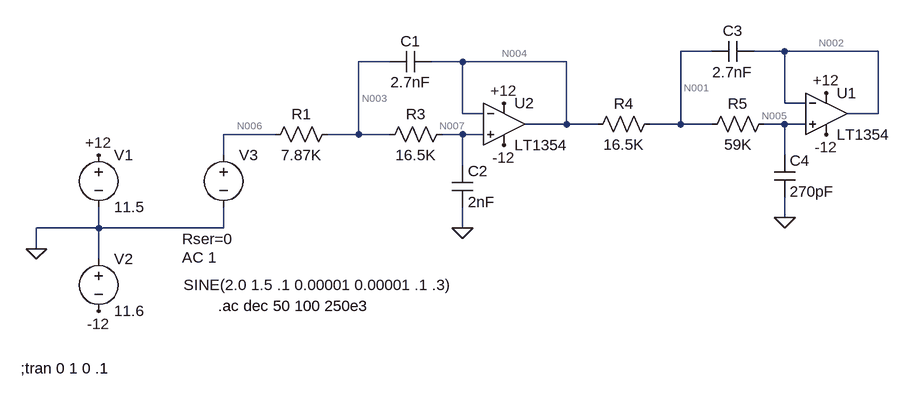
[diagram p0: schematic final_output.asc]
final_output.asc, the LTspice schematic file:
Version 4
SHEET 1 1348 680
WIRE 944 -128 896 -128
WIRE 1056 -128 1008 -128
WIRE 1200 -128 1056 -128
WIRE 448 -112 400 -112
WIRE 560 -112 512 -112
WIRE 720 -112 560 -112
WIRE 1056 -48 1056 -128
WIRE 1088 -48 1056 -48
WIRE 560 -32 560 -112
WIRE 592 -32 560 -32
WIRE 1200 -32 1200 -128
WIRE 1200 -32 1152 -32
WIRE 720 -16 720 -112
WIRE 720 -16 656 -16
WIRE 768 -16 720 -16
WIRE 896 -16 896 -128
WIRE 896 -16 848 -16
WIRE 944 -16 896 -16
WIRE 1056 -16 1024 -16
WIRE 1088 -16 1056 -16
WIRE 272 0 192 0
WIRE 400 0 400 -112
WIRE 400 0 352 0
WIRE 448 0 400 0
WIRE 560 0 528 0
WIRE 592 0 560 0
WIRE 192 32 192 0
WIRE 1056 32 1056 -16
WIRE 560 48 560 0
WIRE 1056 128 1056 96
WIRE 0 144 0 112
WIRE 0 144 -96 144
WIRE 192 144 192 112
WIRE 192 144 0 144
WIRE 560 144 560 112
WIRE -96 176 -96 144
WIRE 0 192 0 144
FLAG -96 176 0
FLAG 0 32 +12
FLAG 0 272 -12
FLAG 560 144 0
FLAG 624 -48 +12
FLAG 624 16 -12
FLAG 1056 128 0
FLAG 1120 -64 +12
FLAG 1120 0 -12
SYMBOL voltage 0 16 R0
WINDOW 123 0 0 Left 0
WINDOW 39 0 0 Left 0
SYMATTR InstName V1
SYMATTR Value 11.5
SYMBOL voltage 0 176 R0
WINDOW 123 0 0 Left 0
WINDOW 39 0 0 Left 0
SYMATTR InstName V2
SYMATTR Value 11.6
SYMBOL res 368 -16 R90
WINDOW 0 0 56 VBottom 2
WINDOW 3 32 56 VTop 2
SYMATTR InstName R1
SYMATTR Value 7.87K
SYMBOL voltage 192 16 R0
WINDOW 3 -61 216 Left 2
WINDOW 123 -64 173 Left 2
WINDOW 39 -64 145 Left 2
SYMATTR Value SINE(2.0 1.5 .1 0.00001 0.00001 .1 .3)
SYMATTR Value2 AC 1
SYMATTR SpiceLine Rser=0
SYMATTR InstName V3
SYMBOL cap 512 -128 R90
WINDOW 0 0 32 VBottom 2
WINDOW 3 32 32 VTop 2
SYMATTR InstName C1
SYMATTR Value 2.7nF
SYMBOL OpAmps\\LT1354 624 -80 R0
SYMATTR InstName U2
SYMBOL res 544 -16 R90
WINDOW 0 0 56 VBottom 2
WINDOW 3 32 56 VTop 2
SYMATTR InstName R3
SYMATTR Value 16.5K
SYMBOL cap 544 48 R0
SYMATTR InstName C2
SYMATTR Value 2nF
SYMBOL res 864 -32 R90
WINDOW 0 0 56 VBottom 2
WINDOW 3 32 56 VTop 2
SYMATTR InstName R4
SYMATTR Value 16.5K
SYMBOL cap 1008 -144 R90
WINDOW 0 0 32 VBottom 2
WINDOW 3 32 32 VTop 2
SYMATTR InstName C3
SYMATTR Value 2.7nF
SYMBOL OpAmps\\LT1354 1120 -96 R0
SYMATTR InstName U1
SYMBOL res 1040 -32 R90
WINDOW 0 0 56 VBottom 2
WINDOW 3 32 56 VTop 2
SYMATTR InstName R5
SYMATTR Value 59K
SYMBOL cap 1040 32 R0
SYMATTR InstName C4
SYMATTR Value 270pF
TEXT -120 360 Left 2 !;tran 0 1 0 .1
TEXT 184 264 Left 2 !.ac dec 50 100 250e3

The netlist it stands for:
* final_output.asc
V1 +12 0 11.5
V2 0 -12 11.6
R1 N003 N006 7.87K
V3 N006 0 SINE(2.0 1.5 .1 0.00001 0.00001 .1 .3) AC 1 Rser=0
C1 N004 N003 2.7nF
XU2 N007 N004 +12 -12 N004 LT1354  ; pins In+ In- V+ V- OUT
R3 N007 N003 16.5K
C2 N007 0 2nF
R4 N001 N004 16.5K
C3 N002 N001 2.7nF
XU1 N005 N002 +12 -12 N002 LT1354  ; pins In+ In- V+ V- OUT
R5 N005 N001 59K
C4 N005 0 270pF
;tran 0 1 0 .1
.ac dec 50 100 250e3
.backanno
.end

* Results of the author's LTspice run, read from the files saved beside the schematic
* Operating Point, zero values left out:
*   V(+12) = 11.5 V
*   V(-12) = -11.6 V
*   V(n003) = 2.002 V
*   V(n006) = 2.003 V
*   V(n004) = 2 V
*   V(n007) = 2 V
*   V(n001) = 1.999 V
*   V(n002) = 1.993 V
*   V(n005) = 1.993 V
*   I(R5) = -93.38 nA
*   I(R4) = -93.38 nA
*   I(R3) = -93.42 nA
*   I(R1) = -93.42 nA
*   I(V3) = -93.42 nA
*   I(V2) = -1.988 mA
*   I(V1) = -1.988 mA
*   Ix(u2:1) = 93.42 nA
*   Ix(u2:2) = 93.41 nA
*   Ix(u2:3) = 994.2 µA
*   Ix(u2:4) = -994.2 µA
*   Ix(u2:5) = -186.8 nA
*   Ix(u1:1) = 93.38 nA
*   Ix(u1:2) = 93.36 nA
*   Ix(u1:3) = 994.2 µA
*   Ix(u1:4) = -994.3 µA
*   Ix(u1:5) = -93.37 nA
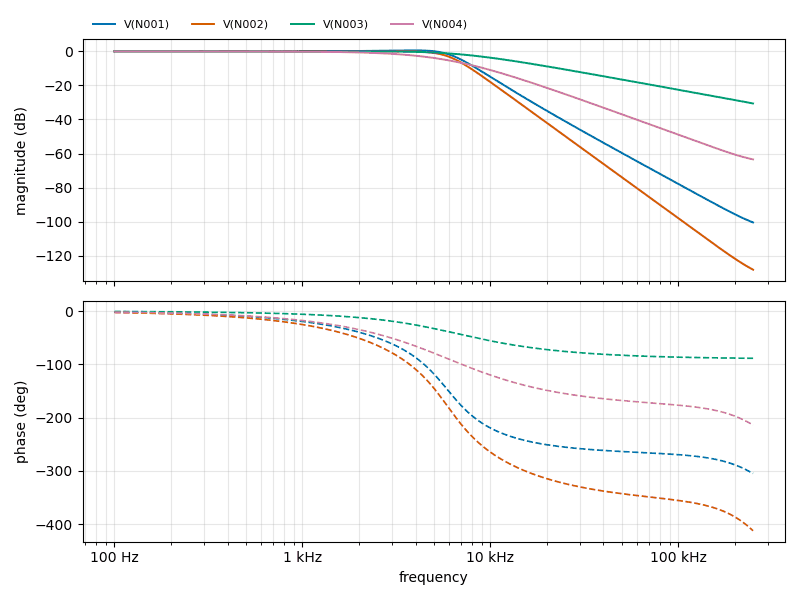
[diagram p1: AC Analysis of final_output.asc, plotted from the saved traces]
* AC Analysis, 1 run:
*   V(N001): -0.00 dB at 100 Hz, -100.40 dB at 250 kHz, peak 0.53 dB at 3.981 kHz, 3 dB below the peak at 6.259 kHz
*   V(N002): -0.01 dB at 100 Hz, -128.12 dB at 250 kHz, peak 0.02 dB at 2.63 kHz, 3 dB below the peak at 5.952 kHz
*   V(N003): -0.00 dB at 100 Hz, -30.59 dB at 250 kHz, peak 0.03 dB at 1.66 kHz, 3 dB below the peak at 8.819 kHz
*   V(N004): -0.00 dB at 100 Hz, -63.39 dB at 250 kHz, peak -0.00 dB at 100 Hz, 3 dB below the peak at 4.341 kHz